# Altium project Configum-2.PrjPcb
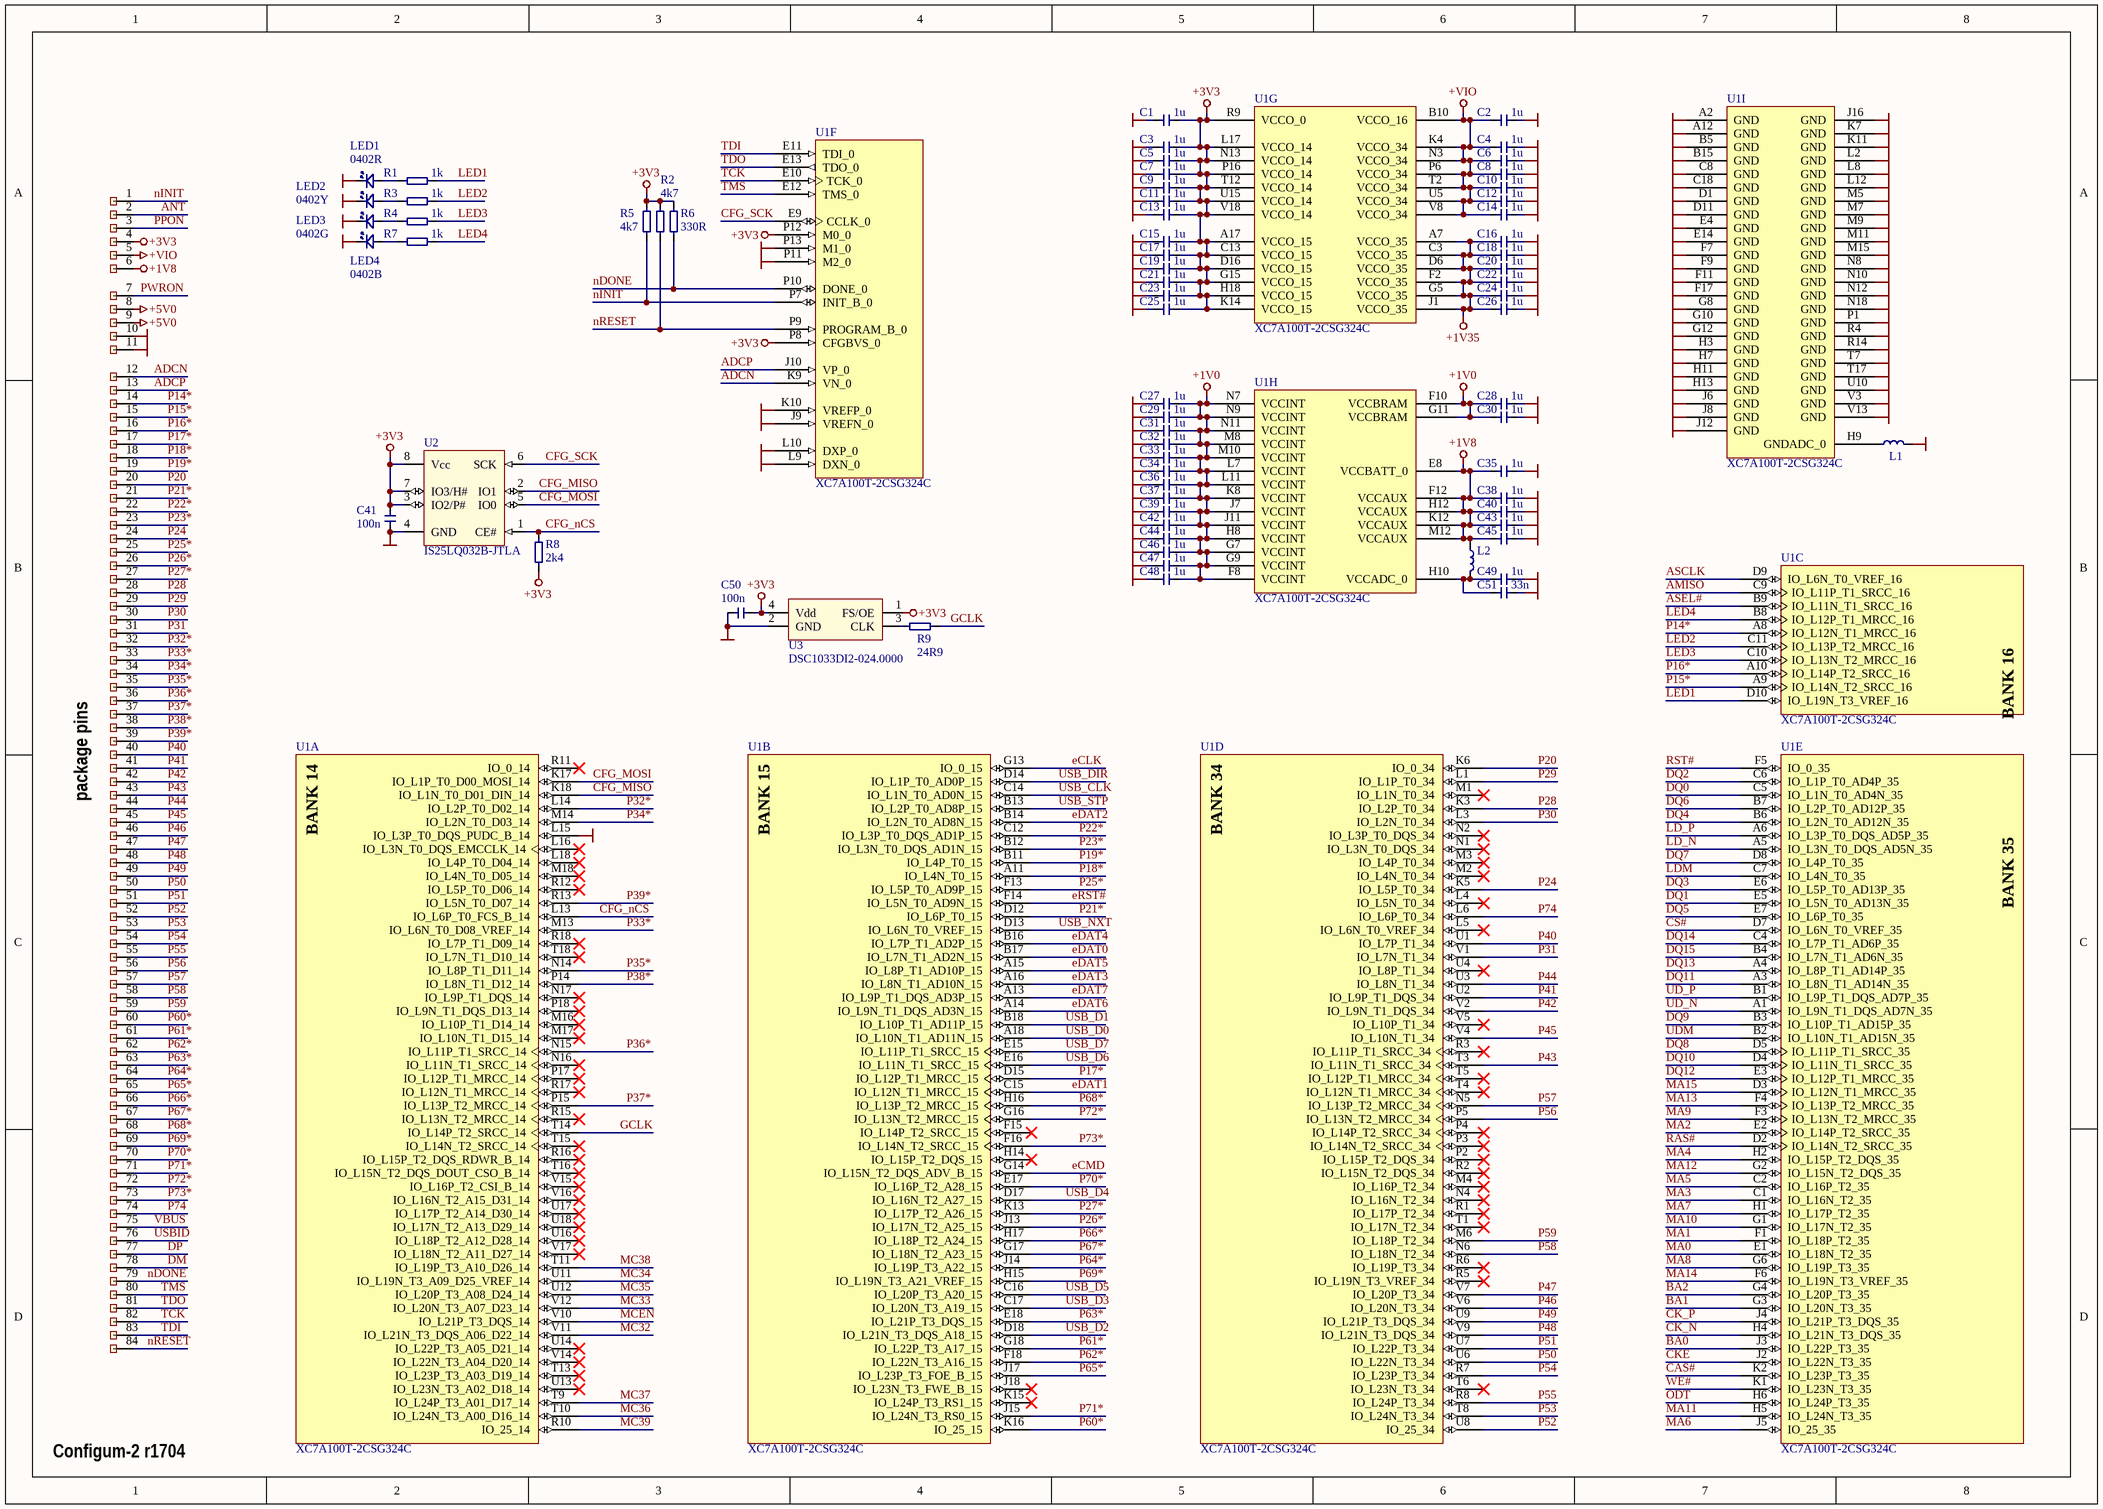
[diagram p0: FPGA.SchDoc]
2 sheets, 273 parts. Net scope: global (net labels, ports and power ports of the same name join across sheets).
Board file: PCB.PcbDoc
Sheets:
  FPGA.SchDoc
  Stuff.SchDoc

## Sheet FPGA.SchDoc
size A3

### Parts
C1  1u  [_0201]
C2  1u  [_0201]
C3  1u  [_0201]
C4  1u  [_0201]
C5  1u  [_0201]
C6  1u  [_0201]
C7  1u  [_0201]
C8  1u  [_0201]
C9  1u  [_0201]
C10  1u  [_0201]
C11  1u  [_0201]
C12  1u  [_0201]
C13  1u  [_0201]
C14  1u  [_0201]
C15  1u  [_0201]
C16  1u  [_0201]
C17  1u  [_0201]
C18  1u  [_0201]
C19  1u  [_0201]
C20  1u  [_0201]
C21  1u  [_0201]
C22  1u  [_0201]
C23  1u  [_0201]
C24  1u  [_0201]
C25  1u  [_0201]
C26  1u  [_0201]
C27  1u  [_0201]
C28  1u  [_0201]
C29  1u  [_0201]
C30  1u  [_0201]
C31  1u  [_0201]
C32  1u  [_0201]
C33  1u  [_0201]
C34  1u  [_0201]
C35  1u  [_0201]
C36  1u  [_0201]
C37  1u  [_0201]
C38  1u  [_0201]
C39  1u  [_0201]
C40  1u  [_0201]
C41  100n  [_0201]
C42  1u  [_0201]
C43  1u  [_0201]
C44  1u  [_0201]
C45  1u  [_0201]
C46  1u  [_0201]
C47  1u  [_0201]
C48  1u  [_0201]
C49  1u  [_0201]
C50  100n  [_0201]
C51  33n  [_0201]
L1  60R/100MHz  [_0201]  (value not drawn)
L2  60R/100MHz  [_0201]  (value not drawn)
LED1  0402R  [_0402+]
LED2  0402Y  [_0402+]
LED3  0402G  [_0402+]
LED4  0402B  [_0402+]
PIN1  Pin/Pad  [PLCC68 pin]  (value not drawn)
PIN2  Pin/Pad  [PLCC68 pin]  (value not drawn)
PIN3  Pin/Pad  [PLCC68 pin]  (value not drawn)
PIN4  Pin/Pad  [PLCC68 pin]  (value not drawn)
PIN5  Pin/Pad  [PLCC68 pin]  (value not drawn)
PIN6  Pin/Pad  [PLCC68 pin]  (value not drawn)
PIN7  Pin/Pad  [PLCC68 pin]  (value not drawn)
PIN8  Pin/Pad  [PLCC68 pin]  (value not drawn)
PIN9  Pin/Pad  [PLCC68 pin]  (value not drawn)
PIN10  Pin/Pad  [PLCC68 pin]  (value not drawn)
PIN11  Pin/Pad  [PLCC68 pin]  (value not drawn)
PIN12  Pin/Pad  [PLCC68 pin]  (value not drawn)
PIN13  Pin/Pad  [PLCC68 pin]  (value not drawn)
PIN14  Pin/Pad  [PLCC68 pin]  (value not drawn)
PIN15  Pin/Pad  [PLCC68 pin]  (value not drawn)
PIN16  Pin/Pad  [PLCC68 pin]  (value not drawn)
PIN17  Pin/Pad  [PLCC68 pin]  (value not drawn)
PIN18  Pin/Pad  [PLCC68 pin]  (value not drawn)
PIN19  Pin/Pad  [PLCC68 pin]  (value not drawn)
PIN20  Pin/Pad  [PLCC68 pin]  (value not drawn)
PIN21  Pin/Pad  [PLCC68 pin]  (value not drawn)
PIN22  Pin/Pad  [PLCC68 pin]  (value not drawn)
PIN23  Pin/Pad  [PLCC68 pin]  (value not drawn)
PIN24  Pin/Pad  [PLCC68 pin]  (value not drawn)
PIN25  Pin/Pad  [PLCC68 pin]  (value not drawn)
PIN26  Pin/Pad  [PLCC68 pin]  (value not drawn)
PIN27  Pin/Pad  [PLCC68 pin]  (value not drawn)
PIN28  Pin/Pad  [PLCC68 pin]  (value not drawn)
PIN29  Pin/Pad  [PLCC68 pin]  (value not drawn)
PIN30  Pin/Pad  [PLCC68 pin]  (value not drawn)
PIN31  Pin/Pad  [PLCC68 pin]  (value not drawn)
PIN32  Pin/Pad  [PLCC68 pin]  (value not drawn)
PIN33  Pin/Pad  [PLCC68 pin]  (value not drawn)
PIN34  Pin/Pad  [PLCC68 pin]  (value not drawn)
PIN35  Pin/Pad  [PLCC68 pin]  (value not drawn)
PIN36  Pin/Pad  [PLCC68 pin]  (value not drawn)
PIN37  Pin/Pad  [PLCC68 pin]  (value not drawn)
PIN38  Pin/Pad  [PLCC68 pin]  (value not drawn)
PIN39  Pin/Pad  [PLCC68 pin]  (value not drawn)
PIN40  Pin/Pad  [PLCC68 pin]  (value not drawn)
PIN41  Pin/Pad  [PLCC68 pin]  (value not drawn)
PIN42  Pin/Pad  [PLCC68 pin]  (value not drawn)
PIN43  Pin/Pad  [PLCC68 pin]  (value not drawn)
PIN44  Pin/Pad  [PLCC68 pin]  (value not drawn)
PIN45  Pin/Pad  [PLCC68 pin]  (value not drawn)
PIN46  Pin/Pad  [PLCC68 pin]  (value not drawn)
PIN47  Pin/Pad  [PLCC68 pin]  (value not drawn)
PIN48  Pin/Pad  [PLCC68 pin]  (value not drawn)
PIN49  Pin/Pad  [PLCC68 pin]  (value not drawn)
PIN50  Pin/Pad  [PLCC68 pin]  (value not drawn)
PIN51  Pin/Pad  [PLCC68 pin]  (value not drawn)
PIN52  Pin/Pad  [PLCC68 pin]  (value not drawn)
PIN53  Pin/Pad  [PLCC68 pin]  (value not drawn)
PIN54  Pin/Pad  [PLCC68 pin]  (value not drawn)
PIN55  Pin/Pad  [PLCC68 pin]  (value not drawn)
PIN56  Pin/Pad  [PLCC68 pin]  (value not drawn)
PIN57  Pin/Pad  [PLCC68 pin]  (value not drawn)
PIN58  Pin/Pad  [PLCC68 pin]  (value not drawn)
PIN59  Pin/Pad  [PLCC68 pin]  (value not drawn)
PIN60  Pin/Pad  [PLCC68 pin]  (value not drawn)
PIN61  Pin/Pad  [PLCC68 pin]  (value not drawn)
PIN62  Pin/Pad  [PLCC68 pin]  (value not drawn)
PIN63  Pin/Pad  [PLCC68 pin]  (value not drawn)
PIN64  Pin/Pad  [PLCC68 pin]  (value not drawn)
PIN65  Pin/Pad  [PLCC68 pin]  (value not drawn)
PIN66  Pin/Pad  [PLCC68 pin]  (value not drawn)
PIN67  Pin/Pad  [PLCC68 pin]  (value not drawn)
PIN68  Pin/Pad  [PLCC68 pin]  (value not drawn)
PIN69  Pin/Pad  [PLCC68 pin]  (value not drawn)
PIN70  Pin/Pad  [PLCC68 pin]  (value not drawn)
PIN71  Pin/Pad  [PLCC68 pin]  (value not drawn)
PIN72  Pin/Pad  [PLCC68 pin]  (value not drawn)
PIN73  Pin/Pad  [PLCC68 pin]  (value not drawn)
PIN74  Pin/Pad  [PLCC68 pin]  (value not drawn)
PIN75  Pin/Pad  [PLCC68 pin]  (value not drawn)
PIN76  Pin/Pad  [PLCC68 pin]  (value not drawn)
PIN77  Pin/Pad  [PLCC68 pin]  (value not drawn)
PIN78  Pin/Pad  [PLCC68 pin]  (value not drawn)
PIN79  Pin/Pad  [PLCC68 pin]  (value not drawn)
PIN80  Pin/Pad  [PLCC68 pin]  (value not drawn)
PIN81  Pin/Pad  [PLCC68 pin]  (value not drawn)
PIN82  Pin/Pad  [PLCC68 pin]  (value not drawn)
PIN83  Pin/Pad  [PLCC68 pin]  (value not drawn)
PIN84  Pin/Pad  [PLCC68 pin]  (value not drawn)
R1  1k  [_0201]
R2  4k7  [_0201]
R3  1k  [_0201]
R4  1k  [_0201]
R5  4k7  [_0201]
R6  330R  [_0201]
R7  1k  [_0201]
R8  2k4  [_0201]
R9  24R9  [_0201]
U1  XC7A100T-2CSG324C  [CSG324]  (parts A,B,C,D,E,F,G,H,I of 9)
U2  IS25LQ032B-JTLA  [SON80P300X60_HS-9L]
U3  DSC1033DI2-024.0000  [Osc 25x20 (4)]

### Nets
+1V0: C27.1 C28.2 C29.1 C30.2 C31.1 C32.1 C33.1 C34.1 C36.1 C37.1 C39.1 C42.1 C44.1 C46.1 C47.1 C48.1 U1.F8(VCCINT) U1.F10(VCCBRAM) U1.G7(VCCINT) U1.G9(VCCINT) U1.G11(VCCBRAM) U1.H8(VCCINT) U1.J7(VCCINT) U1.J11(VCCINT) U1.K8(VCCINT) U1.L7(VCCINT) U1.L11(VCCINT) U1.M8(VCCINT) U1.M10(VCCINT) U1.N7(VCCINT) U1.N9(VCCINT) U1.N11(VCCINT)
+1V8: C35.2 C38.2 C40.2 C43.2 C45.2 L2.2 PIN6.6 U1.E8(VCCBATT_0) U1.F12(VCCAUX) U1.H12(VCCAUX) U1.K12(VCCAUX) U1.M12(VCCAUX)
+1V35: C16.2 C18.2 C20.2 C22.2 C24.2 C26.2 U1.A7(VCCO_35) U1.C3(VCCO_35) U1.D6(VCCO_35) U1.F2(VCCO_35) U1.G5(VCCO_35) U1.J1(VCCO_35)
+3V3: C1.1 C3.1 C5.1 C7.1 C9.1 C11.1 C13.1 C15.1 C17.1 C19.1 C21.1 C23.1 C25.1 C41.2 C50.1 PIN4.4 R2.2 R5.2 R6.1 R8.1 U1.A17(VCCO_15) U1.C13(VCCO_15) U1.D16(VCCO_15) U1.G15(VCCO_15) U1.H18(VCCO_15) U1.K14(VCCO_15) U1.L17(VCCO_14) U1.N13(VCCO_14) U1.P8(CFGBVS_0) U1.P12(M0_0) U1.P16(VCCO_14) U1.R9(VCCO_0) U1.T12(VCCO_14) U1.U15(VCCO_14) U1.V18(VCCO_14) U2.3(IO2/P#) U2.7(IO3/H#) U2.8(Vcc) U3.1(FS/OE) U3.4(Vdd)
+5V0: PIN8.8 PIN9.9
+VIO: C2.2 C4.2 C6.2 C8.2 C10.2 C12.2 C14.2 PIN5.5 U1.B10(VCCO_16) U1.K4(VCCO_34) U1.N3(VCCO_34) U1.P6(VCCO_34) U1.T2(VCCO_34) U1.U5(VCCO_34) U1.V8(VCCO_34)
GND: C1.2 C2.1 C3.2 C4.1 C5.2 C6.1 C7.2 C8.1 C9.2 C10.1 C11.2 C12.1 C13.2 C14.1 C15.2 C16.1 C17.2 C18.1 C19.2 C20.1 C21.2 C22.1 C23.2 C24.1 C25.2 C26.1 C27.2 C28.1 C29.2 C30.1 C31.2 C32.2 C33.2 C34.2 C35.1 C36.2 C37.2 C38.1 C39.2 C40.1 C41.1 C42.2 C43.1 C44.2 C45.1 C46.2 C47.2 C48.2 C49.1 C50.2 C51.1 L1.2 LED1.1 LED2.1 LED3.1 LED4.1 PIN10.10 PIN11.11 U1.A2(GND) U1.A12(GND) U1.B5(GND) U1.B15(GND) U1.C8(GND) U1.C18(GND) U1.D1(GND) U1.D11(GND) U1.E4(GND) U1.E14(GND) U1.F7(GND) U1.F9(GND) U1.F11(GND) U1.F17(GND) U1.G8(GND) U1.G10(GND) U1.G12(GND) U1.H3(GND) U1.H7(GND) U1.H11(GND) U1.H13(GND) U1.J6(GND) U1.J8(GND) U1.J9(VREFN_0) U1.J12(GND) U1.J16(GND) U1.K7(GND) U1.K10(VREFP_0) U1.K11(GND) U1.L2(GND) U1.L8(GND) U1.L9(DXN_0) U1.L10(DXP_0) U1.L12(GND) U1.L15(IO_L3P_T0_DQS_PUDC_B_14) U1.M5(GND) U1.M7(GND) U1.M9(GND) U1.M11(GND) U1.M15(GND) U1.N8(GND) U1.N10(GND) U1.N12(GND) U1.N18(GND) U1.P1(GND) U1.P11(M2_0) U1.P13(M1_0) U1.R4(GND) U1.R14(GND) U1.T7(GND) U1.T17(GND) U1.U10(GND) U1.V3(GND) U1.V13(GND) U2.4(GND) U3.2(GND)
ADCN: PIN12.12 U1.K9(VN_0)
ADCP: PIN13.13 U1.J10(VP_0)
AMISO: U1.C9(IO_L11P_T1_SRCC_16)
ANT: PIN2.2
ASCLK: U1.D9(IO_L6N_T0_VREF_16)
ASEL#: U1.B9(IO_L11N_T1_SRCC_16)
BA0: U1.J3(IO_L22P_T3_35)
BA1: U1.G3(IO_L20N_T3_35)
BA2: U1.G4(IO_L20P_T3_35)
CAS#: U1.K2(IO_L23P_T3_35)
CFG_MISO: U1.K18(IO_L1N_T0_D01_DIN_14) U2.2(IO1)
CFG_MOSI: U1.K17(IO_L1P_T0_D00_MOSI_14) U2.5(IO0)
CFG_nCS: R8.2 U1.L13(IO_L6P_T0_FCS_B_14) U2.1(CE#)
CFG_SCK: U1.E9(CCLK_0) U2.6(SCK)
CK_N: U1.H4(IO_L21N_T3_DQS_35)
CK_P: U1.J4(IO_L21P_T3_DQS_35)
CKE: U1.J2(IO_L22N_T3_35)
CS#: U1.D7(IO_L6N_T0_VREF_35)
DM: PIN78.78
DP: PIN77.77
DQ0: U1.C5(IO_L1N_T0_AD4N_35)
DQ1: U1.E5(IO_L5N_T0_AD13N_35)
DQ2: U1.C6(IO_L1P_T0_AD4P_35)
DQ3: U1.E6(IO_L5P_T0_AD13P_35)
DQ4: U1.B6(IO_L2N_T0_AD12N_35)
DQ5: U1.E7(IO_L6P_T0_35)
DQ6: U1.B7(IO_L2P_T0_AD12P_35)
DQ7: U1.D8(IO_L4P_T0_35)
DQ8: U1.D5(IO_L11P_T1_SRCC_35)
DQ9: U1.B3(IO_L10P_T1_AD15P_35)
DQ10: U1.D4(IO_L11N_T1_SRCC_35)
DQ11: U1.A3(IO_L8N_T1_AD14N_35)
DQ12: U1.E3(IO_L12P_T1_MRCC_35)
DQ13: U1.A4(IO_L8P_T1_AD14P_35)
DQ14: U1.C4(IO_L7P_T1_AD6P_35)
DQ15: U1.B4(IO_L7N_T1_AD6N_35)
eCLK: U1.G13(IO_0_15)
eCMD: U1.G14(IO_L15N_T2_DQS_ADV_B_15)
eDAT0: U1.B17(IO_L7N_T1_AD2N_15)
eDAT1: U1.C15(IO_L12N_T1_MRCC_15)
eDAT2: U1.B14(IO_L2N_T0_AD8N_15)
eDAT3: U1.A16(IO_L8N_T1_AD10N_15)
eDAT4: U1.B16(IO_L7P_T1_AD2P_15)
eDAT5: U1.A15(IO_L8P_T1_AD10P_15)
eDAT6: U1.A14(IO_L9N_T1_DQS_AD3N_15)
eDAT7: U1.A13(IO_L9P_T1_DQS_AD3P_15)
eRST#: U1.F14(IO_L5N_T0_AD9N_15)
GCLK: R9.2 U1.T14(IO_L14P_T2_SRCC_14)
LD_N: U1.A5(IO_L3N_T0_DQS_AD5N_35)
LD_P: U1.A6(IO_L3P_T0_DQS_AD5P_35)
LDM: U1.C7(IO_L4N_T0_35)
LED1: R1.2 U1.D10(IO_L19N_T3_VREF_16)
LED2: R3.2 U1.C11(IO_L13P_T2_MRCC_16)
LED3: R4.2 U1.C10(IO_L13N_T2_MRCC_16)
LED4: R7.2 U1.B8(IO_L12P_T1_MRCC_16)
MA0: U1.E1(IO_L18N_T2_35)
MA1: U1.F1(IO_L18P_T2_35)
MA2: U1.E2(IO_L14P_T2_SRCC_35)
MA3: U1.C1(IO_L16N_T2_35)
MA4: U1.H2(IO_L15P_T2_DQS_35)
MA5: U1.C2(IO_L16P_T2_35)
MA6: U1.J5(IO_25_35)
MA7: U1.H1(IO_L17P_T2_35)
MA8: U1.G6(IO_L19P_T3_35)
MA9: U1.F3(IO_L13N_T2_MRCC_35)
MA10: U1.G1(IO_L17N_T2_35)
MA11: U1.H5(IO_L24N_T3_35)
MA12: U1.G2(IO_L15N_T2_DQS_35)
MA13: U1.F4(IO_L13P_T2_MRCC_35)
MA14: U1.F6(IO_L19N_T3_VREF_35)
MA15: U1.D3(IO_L12N_T1_MRCC_35)
MC32: U1.V11(IO_L21N_T3_DQS_A06_D22_14)
MC33: U1.V12(IO_L20N_T3_A07_D23_14)
MC34: U1.U11(IO_L19N_T3_A09_D25_VREF_14)
MC35: U1.U12(IO_L20P_T3_A08_D24_14)
MC36: U1.T10(IO_L24N_T3_A00_D16_14)
MC37: U1.T9(IO_L24P_T3_A01_D17_14)
MC38: U1.T11(IO_L19P_T3_A10_D26_14)
MC39: U1.R10(IO_25_14)
MCEN: U1.V10(IO_L21P_T3_DQS_14)
nDONE: PIN79.79 R6.2 U1.P10(DONE_0)
nINIT: PIN1.1 R5.1 U1.P7(INIT_B_0)
nRESET: PIN84.84 R2.1 U1.P9(PROGRAM_B_0)
ODT: U1.H6(IO_L24P_T3_35)
P14*: PIN14.14 U1.A8(IO_L12N_T1_MRCC_16)
P15*: PIN15.15 U1.A9(IO_L14N_T2_SRCC_16)
P16*: PIN16.16 U1.A10(IO_L14P_T2_SRCC_16)
P17*: PIN17.17 U1.D15(IO_L12P_T1_MRCC_15)
P18*: PIN18.18 U1.A11(IO_L4N_T0_15)
P19*: PIN19.19 U1.B11(IO_L4P_T0_15)
P20: PIN20.20 U1.K6(IO_0_34)
P21*: PIN21.21 U1.D12(IO_L6P_T0_15)
P22*: PIN22.22 U1.C12(IO_L3P_T0_DQS_AD1P_15)
P23*: PIN23.23 U1.B12(IO_L3N_T0_DQS_AD1N_15)
P24: PIN24.24 U1.K5(IO_L5P_T0_34)
P25*: PIN25.25 U1.F13(IO_L5P_T0_AD9P_15)
P26*: PIN26.26 U1.J13(IO_L17N_T2_A25_15)
P27*: PIN27.27 U1.K13(IO_L17P_T2_A26_15)
P28: PIN28.28 U1.K3(IO_L2P_T0_34)
P29: PIN29.29 U1.L1(IO_L1P_T0_34)
P30: PIN30.30 U1.L3(IO_L2N_T0_34)
P31: PIN31.31 U1.V1(IO_L7N_T1_34)
P32*: PIN32.32 U1.L14(IO_L2P_T0_D02_14)
P33*: PIN33.33 U1.M13(IO_L6N_T0_D08_VREF_14)
P34*: PIN34.34 U1.M14(IO_L2N_T0_D03_14)
P35*: PIN35.35 U1.N14(IO_L8P_T1_D11_14)
P36*: PIN36.36 U1.N15(IO_L11P_T1_SRCC_14)
P37*: PIN37.37 U1.P15(IO_L13P_T2_MRCC_14)
P38*: PIN38.38 U1.P14(IO_L8N_T1_D12_14)
P39*: PIN39.39 U1.R13(IO_L5N_T0_D07_14)
P40: PIN40.40 U1.U1(IO_L7P_T1_34)
P41: PIN41.41 U1.U2(IO_L9P_T1_DQS_34)
P42: PIN42.42 U1.V2(IO_L9N_T1_DQS_34)
P43: PIN43.43 U1.T3(IO_L11N_T1_SRCC_34)
P44: PIN44.44 U1.U3(IO_L8N_T1_34)
P45: PIN45.45 U1.V4(IO_L10N_T1_34)
P46: PIN46.46 U1.V6(IO_L20N_T3_34)
P47: PIN47.47 U1.V7(IO_L20P_T3_34)
P48: PIN48.48 U1.V9(IO_L21N_T3_DQS_34)
P49: PIN49.49 U1.U9(IO_L21P_T3_DQS_34)
P50: PIN50.50 U1.U6(IO_L22N_T3_34)
P51: PIN51.51 U1.U7(IO_L22P_T3_34)
P52: PIN52.52 U1.U8(IO_25_34)
P53: PIN53.53 U1.T8(IO_L24N_T3_34)
P54: PIN54.54 U1.R7(IO_L23P_T3_34)
P55: PIN55.55 U1.R8(IO_L24P_T3_34)
P56: PIN56.56 U1.P5(IO_L13N_T2_MRCC_34)
P57: PIN57.57 U1.N5(IO_L13P_T2_MRCC_34)
P58: PIN58.58 U1.N6(IO_L18N_T2_34)
P59: PIN59.59 U1.M6(IO_L18P_T2_34)
P60*: PIN60.60 U1.K16(IO_25_15)
P61*: PIN61.61 U1.G18(IO_L22P_T3_A17_15)
P62*: PIN62.62 U1.F18(IO_L22N_T3_A16_15)
P63*: PIN63.63 U1.E18(IO_L21P_T3_DQS_15)
P64*: PIN64.64 U1.J14(IO_L19P_T3_A22_15)
P65*: PIN65.65 U1.J17(IO_L23P_T3_FOE_B_15)
P66*: PIN66.66 U1.H17(IO_L18P_T2_A24_15)
P67*: PIN67.67 U1.G17(IO_L18N_T2_A23_15)
P68*: PIN68.68 U1.H16(IO_L13P_T2_MRCC_15)
P69*: PIN69.69 U1.H15(IO_L19N_T3_A21_VREF_15)
P70*: PIN70.70 U1.E17(IO_L16P_T2_A28_15)
P71*: PIN71.71 U1.J15(IO_L24N_T3_RS0_15)
P72*: PIN72.72 U1.G16(IO_L13N_T2_MRCC_15)
P73*: PIN73.73 U1.F16(IO_L14N_T2_SRCC_15)
P74: PIN74.74 U1.L6(IO_L6P_T0_34)
PPON: PIN3.3
PWRON: PIN7.7
RAS#: U1.D2(IO_L14N_T2_SRCC_35)
RST#: U1.F5(IO_0_35)
TCK: PIN82.82 U1.E10(TCK_0)
TDI: PIN83.83 U1.E11(TDI_0)
TDO: PIN81.81 U1.E13(TDO_0)
TMS: PIN80.80 U1.E12(TMS_0)
UD_N: U1.A1(IO_L9N_T1_DQS_AD7N_35)
UD_P: U1.B1(IO_L9P_T1_DQS_AD7P_35)
UDM: U1.B2(IO_L10N_T1_AD15N_35)
USB_CLK: U1.C14(IO_L1N_T0_AD0N_15)
USB_D0: U1.A18(IO_L10N_T1_AD11N_15)
USB_D1: U1.B18(IO_L10P_T1_AD11P_15)
USB_D2: U1.D18(IO_L21N_T3_DQS_A18_15)
USB_D3: U1.C17(IO_L20N_T3_A19_15)
USB_D4: U1.D17(IO_L16N_T2_A27_15)
USB_D5: U1.C16(IO_L20P_T3_A20_15)
USB_D6: U1.E16(IO_L11N_T1_SRCC_15)
USB_D7: U1.E15(IO_L11P_T1_SRCC_15)
USB_DIR: U1.D14(IO_L1P_T0_AD0P_15)
USB_NXT: U1.D13(IO_L6N_T0_VREF_15)
USB_STP: U1.B13(IO_L2P_T0_AD8P_15)
USBID: PIN76.76
VBUS: PIN75.75
WE#: U1.K1(IO_L23N_T3_35)
NetC49_2: C49.2 C51.2 L2.1 U1.H10(VCCADC_0)
NetL1_1: L1.1 U1.H9(GNDADC_0)
NetLED1_2: LED1.2 R1.1
NetLED2_2: LED2.2 R3.1
NetLED3_2: LED3.2 R4.1
NetLED4_2: LED4.2 R7.1
NetR9_1: R9.1 U3.3(CLK)

Not connected (* = marked no-connect by the designer): U1 F15(IO_L14P_T2_SRCC_15)* H14(IO_L15P_T2_DQS_15)* J18(IO_L23N_T3_FWE_B_15)* K15(IO_L24P_T3_RS1_15)* L4(IO_L5N_T0_34)* L5(IO_L6N_T0_VREF_34)* L16(IO_L3N_T0_DQS_EMCCLK_14)* L18(IO_L4P_T0_D04_14)* M1(IO_L1N_T0_34)* M2(IO_L4N_T0_34)* M3(IO_L4P_T0_34)* M4(IO_L16P_T2_34)* M16(IO_L10P_T1_D14_14)* M17(IO_L10N_T1_D15_14)* M18(IO_L4N_T0_D05_14)* N1(IO_L3N_T0_DQS_34)* N2(IO_L3P_T0_DQS_34)* N4(IO_L16N_T2_34)* N16(IO_L11N_T1_SRCC_14)* N17(IO_L9P_T1_DQS_14)* P2(IO_L15P_T2_DQS_34)* P3(IO_L14N_T2_SRCC_34)* P4(IO_L14P_T2_SRCC_34)* P17(IO_L12P_T1_MRCC_14)* P18(IO_L9N_T1_DQS_D13_14)* R1(IO_L17P_T2_34)* R2(IO_L15N_T2_DQS_34)* R3(IO_L11P_T1_SRCC_34)* R5(IO_L19N_T3_VREF_34)* R6(IO_L19P_T3_34)* R11(IO_0_14)* R12(IO_L5P_T0_D06_14)* R15(IO_L13N_T2_MRCC_14)* R16(IO_L15P_T2_DQS_RDWR_B_14)* R17(IO_L12N_T1_MRCC_14)* R18(IO_L7P_T1_D09_14)* T1(IO_L17N_T2_34)* T4(IO_L12N_T1_MRCC_34)* T5(IO_L12P_T1_MRCC_34)* T6(IO_L23N_T3_34)* T13(IO_L23P_T3_A03_D19_14)* T15(IO_L14N_T2_SRCC_14)* T16(IO_L15N_T2_DQS_DOUT_CSO_B_14)* T18(IO_L7N_T1_D10_14)* U4(IO_L8P_T1_34)* U13(IO_L23N_T3_A02_D18_14)* U14(IO_L22P_T3_A05_D21_14)* U16(IO_L18P_T2_A12_D28_14)* U17(IO_L17P_T2_A14_D30_14)* U18(IO_L17N_T2_A13_D29_14)* V5(IO_L10P_T1_34)* V14(IO_L22N_T3_A04_D20_14)* V15(IO_L16P_T2_CSI_B_14)* V16(IO_L16N_T2_A15_D31_14)* V17(IO_L18N_T2_A11_D27_14)*

### Notes on the sheet
- package pins
- Configum-2 r1704
- (in symbol XC7A100T-2CSG324C, part A) BANK 14
- (in symbol XC7A100T-2CSG324C, part B) BANK 15
- (in symbol XC7A100T-2CSG324C, part C) BANK 16
- (in symbol XC7A100T-2CSG324C, part D) BANK 34
- (in symbol XC7A100T-2CSG324C, part E) BANK 35

### Library data of the parts
C1-C51 = Capacitor
L1 L2 = Inductor
LED1-LED4 = LED: Light Emitting Diode
PIN1-PIN84 = Pin/Pad: Single pin/pad
R1-R9 = Resistor
  R1 R3 R4 R7 R9: Digikey: RMCF0402FT3K30CT-ND
U1 = XC7A100T-2CSG324C: Artix-7 FPGA, 210 User I/Os, 0 GTP, 324-Ball BGA, Speed Grade 2, Commercial Grade, Pb-Free; Manufacturer: Xilinx; Block RAM Blocks (18Kb): 270; Block RAM Blocks (36Kb): 135; Block RAM Blocks (Max Kb): 4860; CLBs (Slices): 15850; Clock Mgmt Tiles (CMTs): 6; DSP48E1 Slices: 240; Logic Cells: 101440; Max User I/O: 300; Speed Grade: -2; DatasheetVersion: v1.12; PackageVersion: Rev 1.8; PackageReference: CSG324; PackageDescription: Wire-Bond Chip-Scale BGA, Body 15 x 15 mm, 0.8 mm Pitch; CLBs (Max Distributed RAM Kb): 1188; Generic Part Number: XC7A100T; RoHS: Pb-Free; Mounting Technology: Surface Mount; Code_JEDEC: MO-275-KKAC-1; PartNumber: XC7A100T-2CSG324C; ComponentLink1Description: Datasheet; ComponentLink1URL: http://www.xilinx.com/support/documentation/data_sheets/ds180_7Series_Overview.pdf; ComponentLink2Description: Package Specification; ComponentLink2URL: http://www.xilinx.com/support/documentation/user_guides/ug475_7Series_Pkg_Pinout.pdf; ComponentLink3Description: DC and Switching Characteristics; ComponentLink3URL: http://www.xilinx.com/support/documentation/data_sheets/ds181_Artix_7_Data_Sheet.pdf; ComponentLink4Description: Package File; ComponentLink4URL: http://www.xilinx.com/support/packagefiles/a7packages/xc7a100tcsg324pkg.txt; ComponentLink5Description: Packaging and Pinout; ComponentLink5URL: http://www.xilinx.com/support/documentation/user_guides/ug475_7Series_Pkg_Pinout.pdf
U2 = SPI Flash 8pin: Standard 8-pin SPI flash memory
U3 = Si50x: 32kHz –100MHz CMEMS Oscillator; Manufacturer: Silicon Labs; Option: Si501 (one frequency); Option: Si502 (dual selectable frequency); Option: Si503 (quad selectable frequency)

## Sheet Stuff.SchDoc
size A3
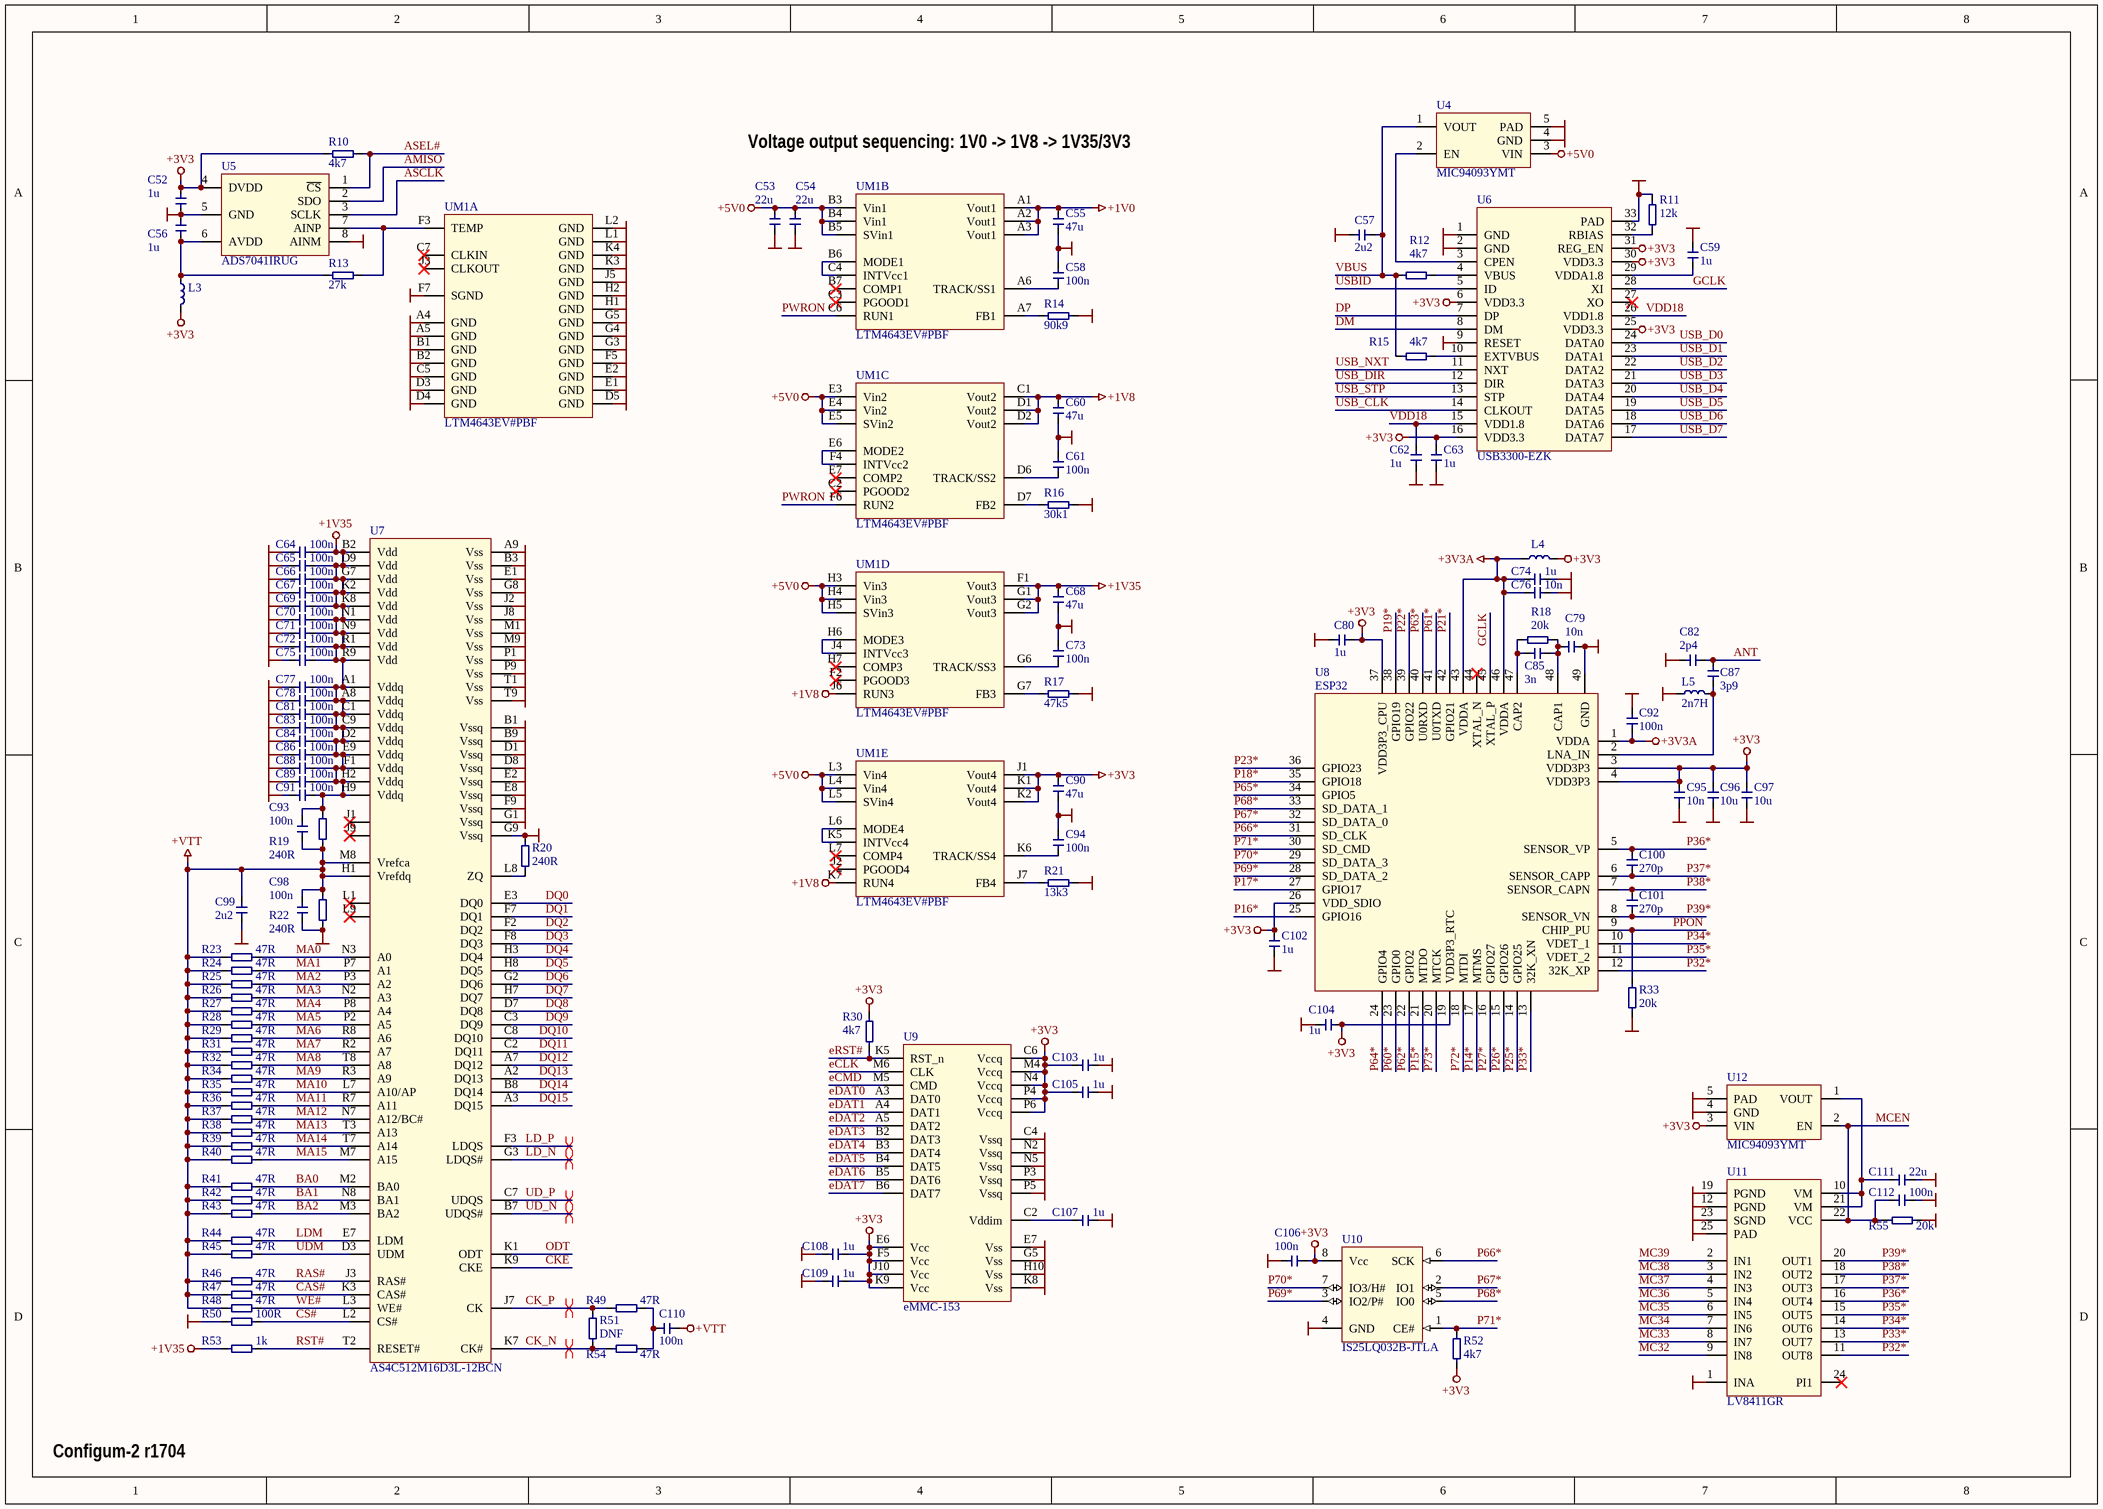
[diagram p1: Stuff.SchDoc]

### Parts
C52  1u  [_0201]
C53  22u  [_0805_CAP]
C54  22u  [_0805_CAP]
C55  47u  [_0805_CAP]
C56  1u  [_0201]
C57  2u2  [_0201]
C58  100n  [_0201]
C59  1u  [_0201]
C60  47u  [_0805_CAP]
C61  100n  [_0201]
C62  1u  [_0201]
C63  1u  [_0201]
C64  100n  [_0201]
C65  100n  [_0201]
C66  100n  [_0201]
C67  100n  [_0201]
C68  47u  [_0805_CAP]
C69  100n  [_0201]
C70  100n  [_0201]
C71  100n  [_0201]
C72  100n  [_0201]
C73  100n  [_0201]
C74  1u  [_0201]
C75  100n  [_0201]
C76  10n  [_0201]
C77  100n  [_0201]
C78  100n  [_0201]
C79  10n  [_0201]
C80  1u  [_0201]
C81  100n  [_0201]
C82  2p4  [_0201]
C83  100n  [_0201]
C84  100n  [_0201]
C85  3n  [_0201]
C86  100n  [_0201]
C87  3p9  [_0201]
C88  100n  [_0201]
C89  100n  [_0201]
C90  47u  [_0805_CAP]
C91  100n  [_0201]
C92  100n  [_0201]
C93  100n  [_0201]
C94  100n  [_0201]
C95  10n  [_0201]
C96  10u  [_0603]
C97  10u  [_0603]
C98  100n  [_0201]
C99  2u2  [_0201]
C100  270p  [_0201]
C101  270p  [_0201]
C102  1u  [_0201]
C103  1u  [_0201]
C104  1u  [_0201]
C105  1u  [_0201]
C106  100n  [_0201]
C107  1u  [_0201]
C108  1u  [_0201]
C109  1u  [_0201]
C110  100n  [_0201]
C111  22u  [_0805_CAP]
C112  100n  [_0201]
L3  60R/100MHz  [_0201]  (value not drawn)
L4  60R/100MHz  [_0201]  (value not drawn)
L5  2n7H  [_0201]
R10  4k7  [_0201]
R11  12k  [_0201]
R12  4k7  [_0201]
R13  27k  [_0201]
R14  90k9  [_0201]
R15  4k7  [_0201]
R16  30k1  [_0201]
R17  47k5  [_0201]
R18  20k  [_0201]
R19  240R  [_0201]
R20  240R  [_0201]
R21  13k3  [_0201]
R22  240R  [_0201]
R23  47R  [_0201]
R24  47R  [_0201]
R25  47R  [_0201]
R26  47R  [_0201]
R27  47R  [_0201]
R28  47R  [_0201]
R29  47R  [_0201]
R30  4k7  [_0201]
R31  47R  [_0201]
R32  47R  [_0201]
R33  20k  [_0201]
R34  47R  [_0201]
R35  47R  [_0201]
R36  47R  [_0201]
R37  47R  [_0201]
R38  47R  [_0201]
R39  47R  [_0201]
R40  47R  [_0201]
R41  47R  [_0201]
R42  47R  [_0201]
R43  47R  [_0201]
R44  47R  [_0201]
R45  47R  [_0201]
R46  47R  [_0201]
R47  47R  [_0201]
R48  47R  [_0201]
R49  47R  [_0201]
R50  100R  [_0201]
R51  DNF  [_0201]
R52  4k7  [_0201]
R53  1k  [_0201]
R54  47R  [_0201]
R55  20k  [_0201]
U4  MIC94093YMT  [DFN65P120x120-4]
U5  ADS7041IRUG  [X2QFN50P150X150-8]
U6  USB3300-EZK  [QFN50P500X500-32V5N]
U7  AS4C512M16D3L-12BCN  [BGA96C80P9X16_900X1400X120]
U8  ESP32  [QFN40P600X600X90-49N-S470]
U9  eMMC-153  [BGA153C50P14X14_1150X1300X90]
U10  IS25LQ032B-JTLA  [SON80P300X60_HS-9L]
U11  LV8411GR  [QFN40P300X300X80_HS-25L]
U12  MIC94093YMT  [DFN65P120x120-4]
UM1  LTM4643EV#PBF  [LGA77C127P7X11_900X1500X182]  (parts A,B,C,D,E of 5)

### Nets
+1V0: C55.1 UM1.A1(Vout1) UM1.A2(Vout1) UM1.A3(Vout1)
+1V8: C60.1 UM1.C1(Vout2) UM1.D1(Vout2) UM1.D2(Vout2) UM1.J6(RUN3) UM1.K7(RUN4)
+1V35: C64.1 C65.1 C66.1 C67.1 C68.1 C69.1 C70.1 C71.1 C72.1 C75.1 C77.1 C78.1 C81.1 C83.1 C84.1 C86.1 C88.1 C89.1 C91.1 C93.1 R19.2 R53.1 U7.A1(Vddq) U7.A8(Vddq) U7.B2(Vdd) U7.C1(Vddq) U7.C9(Vddq) U7.D2(Vddq) U7.D9(Vdd) U7.E9(Vddq) U7.F1(Vddq) U7.G7(Vdd) U7.H2(Vddq) U7.H9(Vddq) U7.K2(Vdd) U7.K8(Vdd) U7.N1(Vdd) U7.N9(Vdd) U7.R1(Vdd) U7.R9(Vdd) UM1.F1(Vout3) UM1.G1(Vout3) UM1.G2(Vout3)
+3V3: C52.2 C63.2 C80.2 C90.1 C95.2 C96.2 C97.2 C102.1 C103.2 C104.1 C105.2 C106.1 C108.1 C109.2 L3.1 L4.2 R10.2 R30.2 R52.1 U5.4(DVDD) U6.6(VDD3.3) U6.16(VDD3.3) U6.25(VDD3.3) U6.30(VDD3.3) U6.31(REG_EN) U8.3(VDD3P3) U8.4(VDD3P3) U8.19(VDD3P3_RTC) U8.26(VDD_SDIO) U8.37(VDD3P3_CPU) U9.C6(Vccq) U9.E6(Vcc) U9.F5(Vcc) U9.J10(Vcc) U9.K9(Vcc) U9.M4(Vccq) U9.N4(Vccq) U9.P4(Vccq) U9.P6(Vccq) U10.8(Vcc) U12.3(VIN) UM1.J1(Vout4) UM1.K1(Vout4) UM1.K2(Vout4)
+3V3A: C74.2 C76.2 C92.2 L4.1 U8.1(VDDA) U8.43(VDDA) U8.46(VDDA)
+5V0: C53.1 C54.1 U4.3(VIN) UM1.B3(Vin1) UM1.B4(Vin1) UM1.B5(SVin1) UM1.E3(Vin2) UM1.E4(Vin2) UM1.E5(SVin2) UM1.H3(Vin3) UM1.H4(Vin3) UM1.H5(SVin3) UM1.L3(Vin4) UM1.L4(Vin4) UM1.L5(SVin4)
+VTT: C93.2 C98.1 C99.1 C110.2 R19.1 R22.2 R23.1 R24.1 R25.1 R26.1 R27.1 R28.1 R29.1 R31.1 R32.1 R34.1 R35.1 R36.1 R37.1 R38.1 R39.1 R40.1 R41.1 R42.1 R43.1 R44.1 R45.1 R46.1 R47.1 R48.1 U7.H1(Vrefdq) U7.M8(Vrefca)
GND: C52.1 C53.2 C54.2 C55.2 C56.2 C57.1 C58.2 C59.1 C60.2 C61.2 C62.1 C63.1 C64.2 C65.2 C66.2 C67.2 C68.2 C69.2 C70.2 C71.2 C72.2 C73.2 C74.1 C75.2 C76.1 C77.2 C78.2 C79.1 C80.1 C81.2 C82.1 C83.2 C84.2 C86.2 C88.2 C89.2 C90.2 C91.2 C92.1 C94.2 C95.1 C96.1 C97.1 C98.2 C99.2 C102.2 C103.1 C104.2 C105.1 C106.2 C107.1 C108.2 C109.1 C111.2 C112.1 L5.1 R11.1 R14.2 R16.2 R17.2 R20.2 R21.2 R22.1 R33.1 R50.1 R55.1 U4.4(GND) U4.5(PAD) U5.5(GND) U5.8(AINM) U6.1(GND) U6.2(GND) U6.9(RESET) U6.33(PAD) U7.A9(Vss) U7.B1(Vssq) U7.B3(Vss) U7.B9(Vssq) U7.D1(Vssq) U7.D8(Vssq) U7.E1(Vss) U7.E2(Vssq) U7.E8(Vssq) U7.F9(Vssq) U7.G1(Vssq) U7.G8(Vss) U7.G9(Vssq) U7.J2(Vss) U7.J8(Vss) U7.M1(Vss) U7.M9(Vss) U7.P1(Vss) U7.P9(Vss) U7.T1(Vss) U7.T9(Vss) U8.49(GND) U9.C4(Vssq) U9.E7(Vss) U9.G5(Vss) U9.H10(Vss) U9.K8(Vss) U9.N2(Vssq) U9.N5(Vssq) U9.P3(Vssq) U9.P5(Vssq) U10.4(GND) U11.1(INA) U11.12(PGND) U11.19(PGND) U11.23(SGND) U11.25(PAD) U12.4(GND) U12.5(PAD) UM1.A4(GND) UM1.A5(GND) UM1.B1(GND) UM1.B2(GND) UM1.C5(GND) UM1.D3(GND) UM1.D4(GND) UM1.D5(GND) UM1.E1(GND) UM1.E2(GND) UM1.F5(GND) UM1.F7(SGND) UM1.G3(GND) UM1.G4(GND) UM1.G5(GND) UM1.H1(GND) UM1.H2(GND) UM1.J5(GND) UM1.K3(GND) UM1.K4(GND) UM1.L1(GND) UM1.L2(GND)
AMISO: U5.2(SDO)
ANT: C82.2 C87.1
ASCLK: U5.3(SCLK)
ASEL#: R10.1 U5.1(~{CS})
BA0: R41.2 U7.M2(BA0)
BA1: R42.2 U7.N8(BA1)
BA2: R43.2 U7.M3(BA2)
CAS#: R47.2 U7.K3(CAS#)
CK_N: R51.2 R54.2 U7.K7(CK#)
CK_P: R49.2 R51.1 U7.J7(CK)
CKE: U7.K9(CKE)
CS#: R50.2 U7.L2(CS#)
DM: U6.8(DM)
DP: U6.7(DP)
DQ0: U7.E3(DQ0)
DQ1: U7.F7(DQ1)
DQ2: U7.F2(DQ2)
DQ3: U7.F8(DQ3)
DQ4: U7.H3(DQ4)
DQ5: U7.H8(DQ5)
DQ6: U7.G2(DQ6)
DQ7: U7.H7(DQ7)
DQ8: U7.D7(DQ8)
DQ9: U7.C3(DQ9)
DQ10: U7.C8(DQ10)
DQ11: U7.C2(DQ11)
DQ12: U7.A7(DQ12)
DQ13: U7.A2(DQ13)
DQ14: U7.B8(DQ14)
DQ15: U7.A3(DQ15)
eCLK: U9.M6(CLK)
eCMD: U9.M5(CMD)
eDAT0: U9.A3(DAT0)
eDAT1: U9.A4(DAT1)
eDAT2: U9.A5(DAT2)
eDAT3: U9.B2(DAT3)
eDAT4: U9.B3(DAT4)
eDAT5: U9.B4(DAT5)
eDAT6: U9.B5(DAT6)
eDAT7: U9.B6(DAT7)
eRST#: R30.1 U9.K5(RST_n)
GCLK: U6.28(XI) U8.45(XTAL_P)
LD_N: U7.G3(LDQS#)
LD_P: U7.F3(LDQS)
LDM: R44.2 U7.E7(LDM)
MA0: R23.2 U7.N3(A0)
MA1: R24.2 U7.P7(A1)
MA2: R25.2 U7.P3(A2)
MA3: R26.2 U7.N2(A3)
MA4: R27.2 U7.P8(A4)
MA5: R28.2 U7.P2(A5)
MA6: R29.2 U7.R8(A6)
MA7: R31.2 U7.R2(A7)
MA8: R32.2 U7.T8(A8)
MA9: R34.2 U7.R3(A9)
MA10: R35.2 U7.L7(A10/AP)
MA11: R36.2 U7.R7(A11)
MA12: R37.2 U7.N7(A12/BC#)
MA13: R38.2 U7.T3(A13)
MA14: R39.2 U7.T7(A14)
MA15: R40.2 U7.M7(A15)
MC32: U11.9(IN8)
MC33: U11.8(IN7)
MC34: U11.7(IN6)
MC35: U11.6(IN5)
MC36: U11.5(IN4)
MC37: U11.4(IN3)
MC38: U11.3(IN2)
MC39: U11.2(IN1)
MCEN: C112.2 R55.2 U11.22(VCC) U12.2(EN)
ODT: U7.K1(ODT)
P14*: U8.17(MTMS)
P15*: U8.21(MTDO)
P16*: U8.25(GPIO16)
P17*: U8.27(GPIO17)
P18*: U8.35(GPIO18)
P19*: U8.38(GPIO19)
P21*: U8.42(GPIO21)
P22*: U8.39(GPIO22)
P23*: U8.36(GPIO23)
P25*: U8.14(GPIO25)
P26*: U8.15(GPIO26)
P27*: U8.16(GPIO27)
P32*: U8.12(32K_XP) U11.11(OUT8)
P33*: U8.13(32K_XN) U11.13(OUT7)
P34*: U8.10(VDET_1) U11.14(OUT6)
P35*: U8.11(VDET_2) U11.15(OUT5)
P36*: C100.2 U8.5(SENSOR_VP) U11.16(OUT4)
P37*: C100.1 U8.6(SENSOR_CAPP) U11.17(OUT3)
P38*: C101.2 U8.7(SENSOR_CAPN) U11.18(OUT2)
P39*: C101.1 U8.8(SENSOR_VN) U11.20(OUT1)
P60*: U8.23(GPIO0)
P61*: U8.41(U0TXD)
P62*: U8.22(GPIO2)
P63*: U8.40(U0RXD)
P64*: U8.24(GPIO4)
P65*: U8.34(GPIO5)
P66*: U8.31(SD_CLK) U10.6(SCK)
P67*: U8.32(SD_DATA_0) U10.2(IO1)
P68*: U8.33(SD_DATA_1) U10.5(IO0)
P69*: U8.28(SD_DATA_2) U10.3(IO2/P#)
P70*: U8.29(SD_DATA_3) U10.7(IO3/H#)
P71*: R52.2 U8.30(SD_CMD) U10.1(CE#)
P72*: U8.18(MTDI)
P73*: U8.20(MTCK)
PPON: R33.2 U8.9(CHIP_PU)
PWRON: UM1.C6(RUN1) UM1.F6(RUN2)
RAS#: R46.2 U7.J3(RAS#)
RST#: R53.2 U7.T2(RESET#)
UD_N: U7.B7(UDQS#)
UD_P: U7.C7(UDQS)
UDM: R45.2 U7.D3(UDM)
USB_CLK: U6.14(CLKOUT)
USB_D0: U6.24(DATA0)
USB_D1: U6.23(DATA1)
USB_D2: U6.22(DATA2)
USB_D3: U6.21(DATA3)
USB_D4: U6.20(DATA4)
USB_D5: U6.19(DATA5)
USB_D6: U6.18(DATA6)
USB_D7: U6.17(DATA7)
USB_DIR: U6.12(DIR)
USB_NXT: U6.11(NXT)
USB_STP: U6.13(STP)
USBID: U6.5(ID)
VBUS: C57.2 R12.1 R15.1 U4.1(VOUT)
VDD18: C62.2 U6.15(VDD1.8) U6.26(VDD1.8)
WE#: R48.2 U7.L3(WE#)
NetC56_1: C56.1 L3.2 R13.2 U5.6(AVDD)
NetC58_1: C58.1 UM1.A6(TRACK/SS1)
NetC59_2: C59.2 U6.29(VDDA1.8)
NetC61_1: C61.1 UM1.D6(TRACK/SS2)
NetC73_1: C73.1 UM1.G6(TRACK/SS3)
NetC79_2: C79.2 C85.1 R18.2 U8.48(CAP1)
NetC85_2: C85.2 R18.1 U8.47(CAP2)
NetC87_2: C87.2 L5.2 U8.2(LNA_IN)
NetC94_1: C94.1 UM1.K6(TRACK/SS4)
NetC107_2: C107.2 U9.C2(Vddim)
NetC110_1: C110.1 R49.1 R54.1
NetC111_1: C111.1 U11.10(VM) U11.21(VM) U12.1(VOUT)
NetR11_2: R11.2 U6.32(RBIAS)
NetR12_2: R12.2 U6.4(VBUS)
NetR13_1: R13.1 U5.7(AINP) UM1.F3(TEMP)
NetR14_1: R14.1 UM1.A7(FB1)
NetR15_2: R15.2 U6.10(EXTVBUS)
NetR16_1: R16.1 UM1.D7(FB2)
NetR17_1: R17.1 UM1.G7(FB3)
NetR20_1: R20.1 U7.L8(ZQ)
NetR21_1: R21.1 UM1.J7(FB4)
NetU4_2: U4.2(EN) U6.3(CPEN)
NetUM1_B6: UM1.B6(MODE1) UM1.C4(INTVcc1)
NetUM1_E6: UM1.E6(MODE2) UM1.F4(INTVcc2)
NetUM1_H6: UM1.H6(MODE3) UM1.J4(INTVcc3)
NetUM1_K5: UM1.K5(INTVcc4) UM1.L6(MODE4)

Not connected (* = marked no-connect by the designer): U6 27(XO)*; U7 J1* J9* L1* L9*; U8 44(XTAL_N)*; U11 24(PI1)*; UM1 B7(COMP1)* C2(PGOOD2)* C3(PGOOD1)* C7(CLKIN)* E7(COMP2)* F2(PGOOD3)* H7(COMP3)* J2(PGOOD4)* J3(CLKOUT)* L7(COMP4)*

### Layout directives
differential pair: CK_N, CK_P, LD_N, LD_P, UD_N, UD_P

### Notes on the sheet
- Voltage output sequencing: 1V0 -> 1V8 -> 1V35/3V3
- Configum-2 r1704

### Library data of the parts
C52-C112 = Capacitor
L3-L5 = Inductor
R10-R55 = Resistor
  R10-R51 R53-R55: Digikey: RMCF0402FT3K30CT-ND
U4 U12 = MIC9409x (1.2x1.2 Thin MLF): High-side load switch for consumer applications; Manufacturer: Microchip
U5 = ADS7041 (Q2QFN 1.5x1.5): Ultra-Low Power, Ultra-Small Size, 10-Bit, 1-MSPS, SAR ADC; Manufacturer: Texas Instruments
U6 = USB3300: Hi-Speed USB Host, Device or OTG PHY with  ULPI Low Pin Interface; Manufacturer: Microchip
U7 = AS4C512M16D3L: DDR3L RAM 8Gb (512Mx16); Manufacturer: Alliance Semiconductor; Organisation: DDR3L (1.35V) 8x64Mx16
U8 = ESP32: WiFi, BT4.2, 2xCPU integrated solution; Manufacturer: Espressif
U9 = eMMC: eMMC memory; Manufacturer: Micron
U10 = SPI Flash 8pin: Standard 8-pin SPI flash memory
U11 = LV8411GR: 4-channel single chip motor driver IC; Manufacturer: On Semiconductor
UM1 = LTM4643: Ultrathin Quad Module Regulator with Configurable 3A Output Array; Manufacturer: Linear

## Nets that join several sheets
+1V0: FPGA (32 pins), Stuff (C55.1 UM1.A1 UM1.A2 UM1.A3)
+1V8: FPGA (12 pins), Stuff (6 pins)
+1V35: FPGA (12 pins), Stuff (43 pins)
+3V3: FPGA (40 pins), Stuff (44 pins)
+5V0: FPGA (PIN8.8 PIN9.9), Stuff (15 pins)
GND: FPGA (114 pins), Stuff (135 pins)
AMISO: FPGA (U1.C9), Stuff (U5.2)
ANT: FPGA (PIN2.2), Stuff (C82.2 C87.1)
ASCLK: FPGA (U1.D9), Stuff (U5.3)
ASEL#: FPGA (U1.B9), Stuff (R10.1 U5.1)
BA0: FPGA (U1.J3), Stuff (R41.2 U7.M2)
BA1: FPGA (U1.G3), Stuff (R42.2 U7.N8)
BA2: FPGA (U1.G4), Stuff (R43.2 U7.M3)
CAS#: FPGA (U1.K2), Stuff (R47.2 U7.K3)
CK_N: FPGA (U1.H4), Stuff (R51.2 R54.2 U7.K7)
CK_P: FPGA (U1.J4), Stuff (R49.2 R51.1 U7.J7)
CKE: FPGA (U1.J2), Stuff (U7.K9)
CS#: FPGA (U1.D7), Stuff (R50.2 U7.L2)
DM: FPGA (PIN78.78), Stuff (U6.8)
DP: FPGA (PIN77.77), Stuff (U6.7)
DQ0: FPGA (U1.C5), Stuff (U7.E3)
DQ1: FPGA (U1.E5), Stuff (U7.F7)
DQ2: FPGA (U1.C6), Stuff (U7.F2)
DQ3: FPGA (U1.E6), Stuff (U7.F8)
DQ4: FPGA (U1.B6), Stuff (U7.H3)
DQ5: FPGA (U1.E7), Stuff (U7.H8)
DQ6: FPGA (U1.B7), Stuff (U7.G2)
DQ7: FPGA (U1.D8), Stuff (U7.H7)
DQ8: FPGA (U1.D5), Stuff (U7.D7)
DQ9: FPGA (U1.B3), Stuff (U7.C3)
DQ10: FPGA (U1.D4), Stuff (U7.C8)
DQ11: FPGA (U1.A3), Stuff (U7.C2)
DQ12: FPGA (U1.E3), Stuff (U7.A7)
DQ13: FPGA (U1.A4), Stuff (U7.A2)
DQ14: FPGA (U1.C4), Stuff (U7.B8)
DQ15: FPGA (U1.B4), Stuff (U7.A3)
eCLK: FPGA (U1.G13), Stuff (U9.M6)
eCMD: FPGA (U1.G14), Stuff (U9.M5)
eDAT0: FPGA (U1.B17), Stuff (U9.A3)
eDAT1: FPGA (U1.C15), Stuff (U9.A4)
eDAT2: FPGA (U1.B14), Stuff (U9.A5)
eDAT3: FPGA (U1.A16), Stuff (U9.B2)
eDAT4: FPGA (U1.B16), Stuff (U9.B3)
eDAT5: FPGA (U1.A15), Stuff (U9.B4)
eDAT6: FPGA (U1.A14), Stuff (U9.B5)
eDAT7: FPGA (U1.A13), Stuff (U9.B6)
eRST#: FPGA (U1.F14), Stuff (R30.1 U9.K5)
GCLK: FPGA (R9.2 U1.T14), Stuff (U6.28 U8.45)
LD_N: FPGA (U1.A5), Stuff (U7.G3)
LD_P: FPGA (U1.A6), Stuff (U7.F3)
LDM: FPGA (U1.C7), Stuff (R44.2 U7.E7)
MA0: FPGA (U1.E1), Stuff (R23.2 U7.N3)
MA1: FPGA (U1.F1), Stuff (R24.2 U7.P7)
MA2: FPGA (U1.E2), Stuff (R25.2 U7.P3)
MA3: FPGA (U1.C1), Stuff (R26.2 U7.N2)
MA4: FPGA (U1.H2), Stuff (R27.2 U7.P8)
MA5: FPGA (U1.C2), Stuff (R28.2 U7.P2)
MA6: FPGA (U1.J5), Stuff (R29.2 U7.R8)
MA7: FPGA (U1.H1), Stuff (R31.2 U7.R2)
MA8: FPGA (U1.G6), Stuff (R32.2 U7.T8)
MA9: FPGA (U1.F3), Stuff (R34.2 U7.R3)
MA10: FPGA (U1.G1), Stuff (R35.2 U7.L7)
MA11: FPGA (U1.H5), Stuff (R36.2 U7.R7)
MA12: FPGA (U1.G2), Stuff (R37.2 U7.N7)
MA13: FPGA (U1.F4), Stuff (R38.2 U7.T3)
MA14: FPGA (U1.F6), Stuff (R39.2 U7.T7)
MA15: FPGA (U1.D3), Stuff (R40.2 U7.M7)
MC32: FPGA (U1.V11), Stuff (U11.9)
MC33: FPGA (U1.V12), Stuff (U11.8)
MC34: FPGA (U1.U11), Stuff (U11.7)
MC35: FPGA (U1.U12), Stuff (U11.6)
MC36: FPGA (U1.T10), Stuff (U11.5)
MC37: FPGA (U1.T9), Stuff (U11.4)
MC38: FPGA (U1.T11), Stuff (U11.3)
MC39: FPGA (U1.R10), Stuff (U11.2)
MCEN: FPGA (U1.V10), Stuff (C112.2 R55.2 U11.22 U12.2)
ODT: FPGA (U1.H6), Stuff (U7.K1)
P14*: FPGA (PIN14.14 U1.A8), Stuff (U8.17)
P15*: FPGA (PIN15.15 U1.A9), Stuff (U8.21)
P16*: FPGA (PIN16.16 U1.A10), Stuff (U8.25)
P17*: FPGA (PIN17.17 U1.D15), Stuff (U8.27)
P18*: FPGA (PIN18.18 U1.A11), Stuff (U8.35)
P19*: FPGA (PIN19.19 U1.B11), Stuff (U8.38)
P21*: FPGA (PIN21.21 U1.D12), Stuff (U8.42)
P22*: FPGA (PIN22.22 U1.C12), Stuff (U8.39)
P23*: FPGA (PIN23.23 U1.B12), Stuff (U8.36)
P25*: FPGA (PIN25.25 U1.F13), Stuff (U8.14)
P26*: FPGA (PIN26.26 U1.J13), Stuff (U8.15)
P27*: FPGA (PIN27.27 U1.K13), Stuff (U8.16)
P32*: FPGA (PIN32.32 U1.L14), Stuff (U8.12 U11.11)
P33*: FPGA (PIN33.33 U1.M13), Stuff (U8.13 U11.13)
P34*: FPGA (PIN34.34 U1.M14), Stuff (U8.10 U11.14)
P35*: FPGA (PIN35.35 U1.N14), Stuff (U8.11 U11.15)
P36*: FPGA (PIN36.36 U1.N15), Stuff (C100.2 U8.5 U11.16)
P37*: FPGA (PIN37.37 U1.P15), Stuff (C100.1 U8.6 U11.17)
P38*: FPGA (PIN38.38 U1.P14), Stuff (C101.2 U8.7 U11.18)
P39*: FPGA (PIN39.39 U1.R13), Stuff (C101.1 U8.8 U11.20)
P60*: FPGA (PIN60.60 U1.K16), Stuff (U8.23)
P61*: FPGA (PIN61.61 U1.G18), Stuff (U8.41)
P62*: FPGA (PIN62.62 U1.F18), Stuff (U8.22)
P63*: FPGA (PIN63.63 U1.E18), Stuff (U8.40)
P64*: FPGA (PIN64.64 U1.J14), Stuff (U8.24)
P65*: FPGA (PIN65.65 U1.J17), Stuff (U8.34)
P66*: FPGA (PIN66.66 U1.H17), Stuff (U8.31 U10.6)
P67*: FPGA (PIN67.67 U1.G17), Stuff (U8.32 U10.2)
P68*: FPGA (PIN68.68 U1.H16), Stuff (U8.33 U10.5)
P69*: FPGA (PIN69.69 U1.H15), Stuff (U8.28 U10.3)
P70*: FPGA (PIN70.70 U1.E17), Stuff (U8.29 U10.7)
P71*: FPGA (PIN71.71 U1.J15), Stuff (R52.2 U8.30 U10.1)
P72*: FPGA (PIN72.72 U1.G16), Stuff (U8.18)
P73*: FPGA (PIN73.73 U1.F16), Stuff (U8.20)
PPON: FPGA (PIN3.3), Stuff (R33.2 U8.9)
PWRON: FPGA (PIN7.7), Stuff (UM1.C6 UM1.F6)
RAS#: FPGA (U1.D2), Stuff (R46.2 U7.J3)
RST#: FPGA (U1.F5), Stuff (R53.2 U7.T2)
UD_N: FPGA (U1.A1), Stuff (U7.B7)
UD_P: FPGA (U1.B1), Stuff (U7.C7)
UDM: FPGA (U1.B2), Stuff (R45.2 U7.D3)
USB_CLK: FPGA (U1.C14), Stuff (U6.14)
USB_D0: FPGA (U1.A18), Stuff (U6.24)
USB_D1: FPGA (U1.B18), Stuff (U6.23)
USB_D2: FPGA (U1.D18), Stuff (U6.22)
USB_D3: FPGA (U1.C17), Stuff (U6.21)
USB_D4: FPGA (U1.D17), Stuff (U6.20)
USB_D5: FPGA (U1.C16), Stuff (U6.19)
USB_D6: FPGA (U1.E16), Stuff (U6.18)
USB_D7: FPGA (U1.E15), Stuff (U6.17)
USB_DIR: FPGA (U1.D14), Stuff (U6.12)
USB_NXT: FPGA (U1.D13), Stuff (U6.11)
USB_STP: FPGA (U1.B13), Stuff (U6.13)
USBID: FPGA (PIN76.76), Stuff (U6.5)
VBUS: FPGA (PIN75.75), Stuff (C57.2 R12.1 R15.1 U4.1)
WE#: FPGA (U1.K1), Stuff (R48.2 U7.L3)